# EAGLE design KeyboardSidepanel_stack2 (EAGLE 7.7.0)
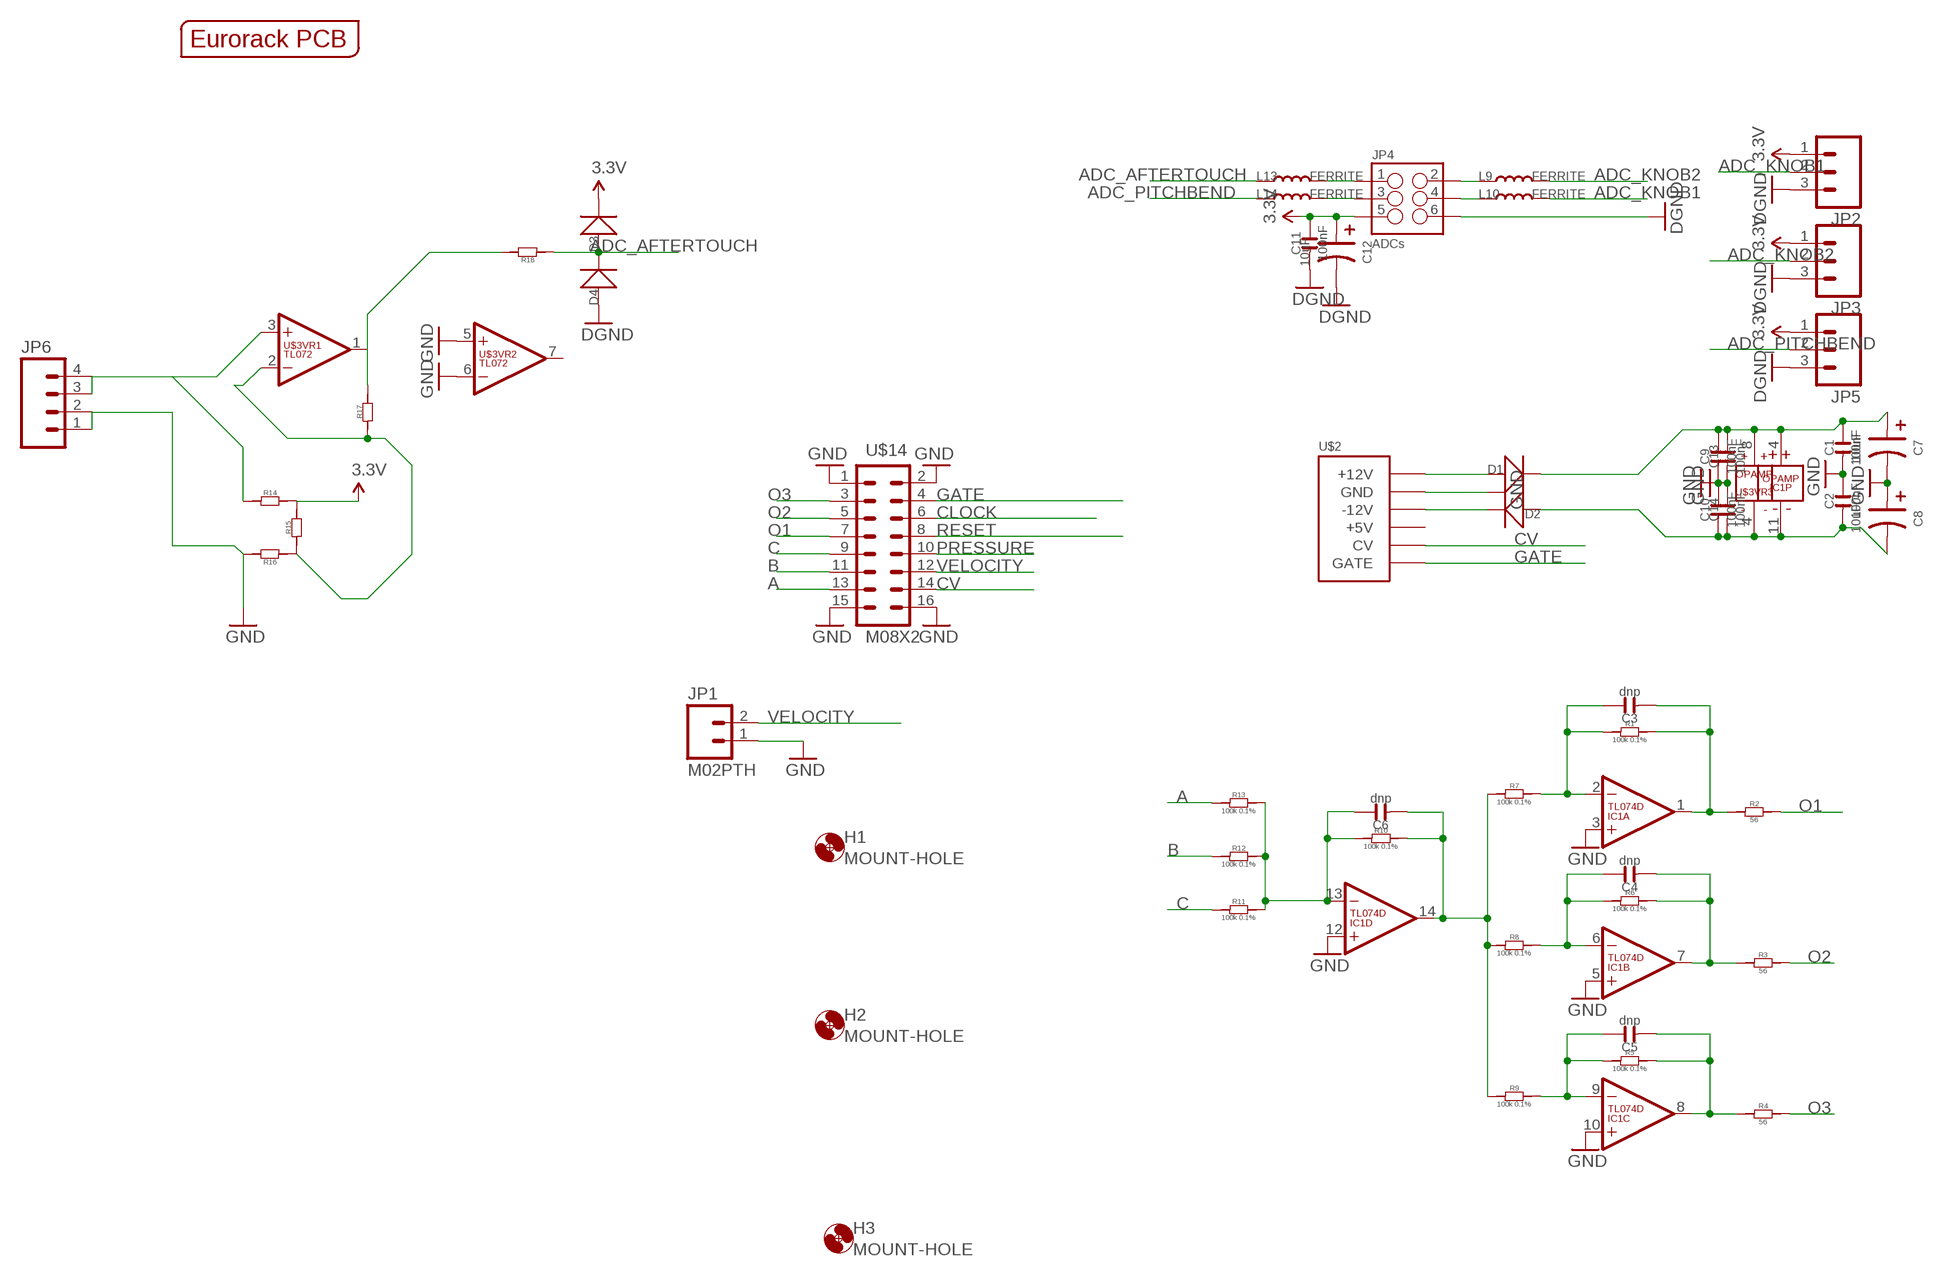
[diagram p0: schematic, sheet 1]

## Parts
C1  100nF  C-0603  [C0603]
C2  100nF  C-0603  [C0603]
C3  dnp  C-0603  [C0603]
C4  dnp  C-0603  [C0603]
C5  dnp  C-0603  [C0603]
C6  dnp  C-0603  [C0603]
C7  10uF  C-POLAR-A  [CASE-A_3216]
C8  10uF  C-POLAR-A  [CASE-A_3216]
C9  100nF  C-0603  [C0603]
C10  100nF  C-0603  [C0603]
C11  100nF  C-0603  [C0603]
C12  10uF  C-POLAR-A  [CASE-A_3216]
C13  100nF  C-0603  [C0603]
C14  100nF  C-0603  [C0603]
D1  D-SOD-123  [SOD123]
D2  D-SOD-123  [SOD123]
D3  D-SOD-123  [SOD123]
D4  D-SOD-123  [SOD123]
H1  MOUNT-HOLE  [3.2-NOMARKINGS-SMALLSAFEZONE]
H2  MOUNT-HOLE  [3.2-NOMARKINGS-SMALLSAFEZONE]
H3  MOUNT-HOLE  [3.2-NOMARKINGS-SMALLSAFEZONE]
IC1  TL074D  [SO14]
JP1  M02PTH  [1X02]
JP2  M03PTH  [1X03]
JP3  M03PTH  [1X03]
JP4  ADCs  M03X2  [2X3-SHROUDED]
JP5  M03PTH  [1X03]
JP6  M04PTH  [1X04]
L9  FERRITE  L-0603  [L0603]
L10  FERRITE  L-0603  [L0603]
L13  FERRITE  L-0603  [L0603]
L14  FERRITE  L-0603  [L0603]
R1  100k 0.1%  R-0603  [R0603]
R2  56  R-0603  [R0603]
R3  56  R-0603  [R0603]
R4  56  R-0603  [R0603]
R5  100k 0.1%  R-0603  [R0603]
R6  100k 0.1%  R-0603  [R0603]
R7  100k 0.1%  R-0603  [R0603]
R8  100k 0.1%  R-0603  [R0603]
R9  100k 0.1%  R-0603  [R0603]
R10  100k 0.1%  R-0603  [R0603]
R11  100k 0.1%  R-0603  [R0603]
R12  100k 0.1%  R-0603  [R0603]
R13  100k 0.1%  R-0603  [R0603]
R14  R-0603  [R0603]
R15  R-0603  [R0603]
R16  R-0603  [R0603]
R17  R-0603  [R0603]
R18  R-0603  [R0603]
U$1  EURORACK_PCB6HP_10CM  [EURORACK6HPPCB_10CMTALL]
U$2  POWERSHROUDED  [POWER_16_SHROUDED]
U$3  TL072  [SO08]
U$14  M08X2  [2X8]

## Nets
3.3V [heavypower]: C11.2 C12.+ D3.- JP2.1 JP3.1 JP4.5 JP5.1 R14.2 R15.2
12V: C1.2 C7.+ C9.2 C13.2 D1.- IC1.4(P:V+) U$3.8(VR3:V+)
-12V: C2.1 C8.- C10.1 C14.1 D2.+ IC1.11(P:V-) U$3.4(VR3:V-)
A: R13.1 U$14.13
ADC_AFTERTOUCH: D3.+ D4.- L13.1 R18.1
ADC_KNOB1: JP2.2 L10.2
ADC_KNOB2: JP3.2 L9.2
ADC_PITCHBEND: JP5.2 L14.1
B: R12.1 U$14.11
C: R11.1 U$14.9
CLOCK: U$14.6
CV: U$2.13(CV) U$2.14(CV) U$14.14
GATE: U$2.15(GATE) U$2.16(GATE) U$14.4
GND: C1.1 C2.2 C7.- C8.+ C9.1 C10.2 C11.1 C12.- C13.1 C14.2 D4.+ IC1.3(A:+IN) IC1.5(B:+IN) IC1.10(C:+IN) IC1.12(D:+IN) JP1.1 JP2.3 JP3.3 JP4.6 JP5.3 JP6.1 JP6.2 R16.2 U$2.3(GND) U$2.4(GND) U$2.5(GND) U$2.6(GND) U$2.7(GND) U$2.8(GND) U$3.5(VR2:+IN) U$3.6(VR2:-IN) U$14.1 U$14.2 U$14.15 U$14.16 ; supply symbol labelled DGND
N$1: C6.1 IC1.14(D:OUT) R7.1 R8.1 R9.1 R10.2
N$2: R17.2 R18.2 U$3.1(VR1:OUT)
N$3: R15.1 R16.1 R17.1 U$3.2(VR1:-IN)
N$4: C6.2 IC1.13(D:-IN) R10.1 R11.2 R12.2 R13.2
N$7: C3.2 IC1.2(A:-IN) R1.1 R7.2
N$8: C4.2 IC1.6(B:-IN) R6.1 R8.2
N$9: C5.2 IC1.9(C:-IN) R5.1 R9.2
N$10: C5.1 IC1.8(C:OUT) R4.1 R5.2
N$11: C4.1 IC1.7(B:OUT) R3.1 R6.2
N$14: C3.1 IC1.1(A:OUT) R1.2 R2.1
N$22: D1.+ U$2.9(+12V) U$2.10(+12V)
N$23: D2.- U$2.1(-12V) U$2.2(-12V)
N$27: JP4.2 L9.1
N$49: JP4.4 L10.1
N$50: JP4.1 L13.2
N$51: JP4.3 L14.2
O1: R2.2 U$14.7
O2: R3.2 U$14.5
O3: R4.2 U$14.3
PRESSURE: U$14.10
RESET: U$14.8
VELOCITY: JP1.2 U$14.12
WHEATR1: JP6.3 JP6.4 R14.1 U$3.3(VR1:+IN)
Unconnected: U$2.11(+5V) U$2.12(+5V) U$3.7(VR2:OUT)

## Library data of the parts
C1-C6 C9-C11 C13 C14 = OPL:C*
C7 C8 C12 = EurorackModularParts:C-POLAR*
D1-D4 = OPL:D*: DIODE
H1-H3 = zephod-components:MOUNT-HOLE: MOUNTING HOLE with drill center marker
IC1 = EurorackModularParts:TL074: OP AMP
JP1 = SparkFun-Connectors:M02: Standard 2-pin 0.1" header. Use with - straight break away headers ( PRT-00116) - right angle break away headers (PRT-00553) - swiss pins (PRT-00743) - machine pins (PRT-00117) - female headers (PRT-00115) Molex polarized connector foot print use with: PRT-08233 with associated crimp pins and housings. 2.54_SCREWTERM for use with PRT-10571. 3.5mm Screw Terminal footprints for PRT-08084 5mm Screw Terminal footprints for use with PRT-08433
JP2 JP3 JP5 = SparkFun-Connectors:M03: Header 3 Standard 3-pin 0.1" header. Use with straight break away headers (SKU : PRT-00116), right angle break away headers (PRT-00553), swiss pins (PRT-00743), machine pins (PRT-00117), and female headers (PRT-00115). Molex polarized connector foot print use with SKU : PRT-08232 with associated crimp pins and housings.
JP4 = SparkFun-Connectors:M03X2: 2x3 .1" header. Shrouded, with keying- CONN-10681 SMT- CONN-11415 Pogo pins- HW-11044; PROD_ID: CONN-10681
JP6 = SparkFun-Connectors:M04: Header 4 Standard 4-pin 0.1" header. Use with straight break away headers (SKU : PRT-00116), right angle break away headers (PRT-00553), swiss pins (PRT-00743), machine pins (PRT-00117), and female headers (PRT-00115). Molex polarized connector foot print use with SKU : PRT-08231 with associated crimp pins and housings. 1MM SMD Version SKU: PRT-10208
L9 L10 L13 L14 = OPL Eagle Library:L*
R1-R18 = OPL:R*
U$1 = EurorackModularParts:EURORACK_PCB
U$2 = EurorackModularParts:POWER
U$3 = EurorackModularParts:TL072
U$14 = SparkFun-Connectors:M08X2: .1" headers, two rows of 8 each

## Net classes
0 default: width 0.305 mm
1 heavypower: width 0.305 mm
3 groundplane: width 0.305 mm

## Board
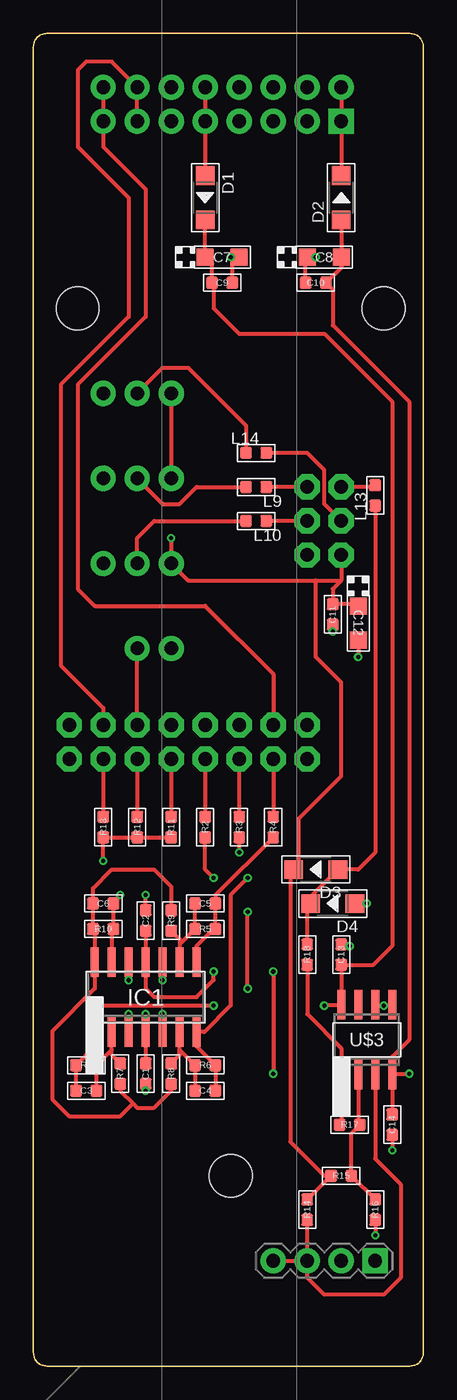
[diagram p1: board, top side]
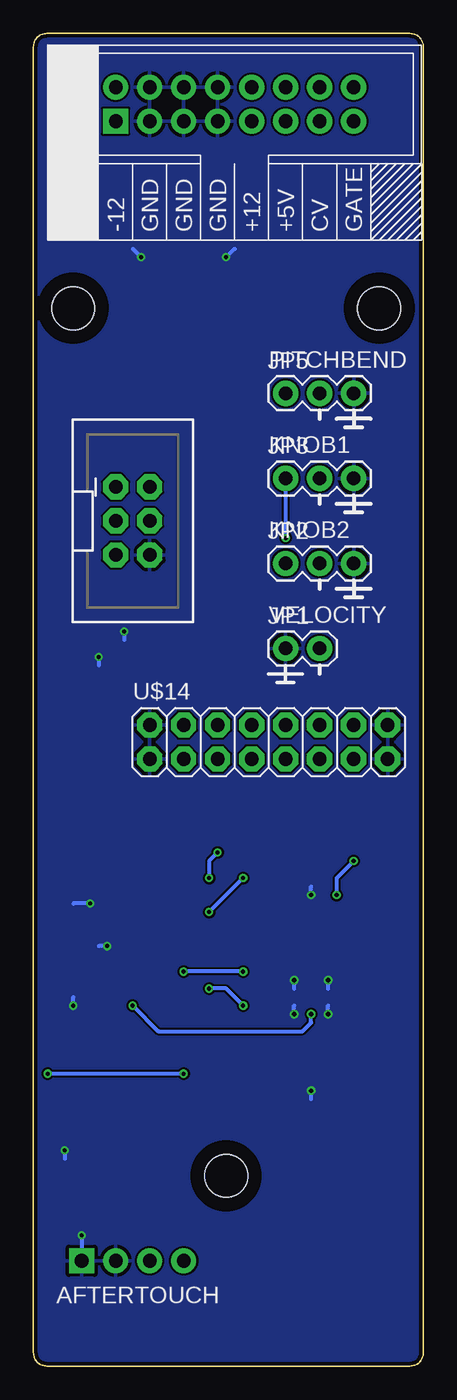
[diagram p2: board, bottom side, seen from below]

Size 29.14 x 99.5 mm. Coordinates in mm from the lower left corner, seen from the top.
Copper layers (1*16): Top 0.035mm / dielectric 1.5mm / Bottom 0.035mm
Design rules "ITEADstudio_DRC": minimum track width 6mil, minimum drill 12mil, track to track 6mil, track to pad 6mil, pad to pad 6mil, via to via 6mil, smd to smd 0mil, copper to edge 10mil, drill to drill 10mil, minimum pad ring 10mil, minimum via ring 6mil, stop-mask expansion 2mil, vias tented up to drill 100mil, thermal gap 10mil

### Footprints (pad centres in the part's own frame; a part is rotated, then mirrored left to right if it is on the bottom)
C0603 = smd 0.889 x 0.889: 1 -0.762,0; 2 0.762,0
CASE-A_3216 = smd 1.27 x 1.27: + -1.27,0; - 1.27,0
SOD123 = smd 1.397 x 1.397: + -1.651,0; - 1.651,0
3.2-NOMARKINGS-SMALLSAFEZONE = hole 3.2: 0,0
SO14 = smd 0.6 x 2.2: 1 -3.81,-2.6; 2 -2.54,-2.6; 3 -1.27,-2.6; 4 0,-2.6; 5 1.27,-2.6; 6 2.54,-2.6; 7 3.81,-2.6; 8 3.81,2.6; 9 2.54,2.6; 10 1.27,2.6; 11 0,2.6; 12 -1.27,2.6; 13 -2.54,2.6; 14 -3.81,2.6
1X02 = drill 1.016 pad 1.88: 1 0,0; 2 2.54,0
1X03 = drill 1.016 pad 1.88: 1 0,0; 2 2.54,0; 3 5.08,0
2X3-SHROUDED = drill 1.016 pad 1.88 octagon: 1 -1.27,2.54; 2 1.27,2.54; 3 -1.27,0; 4 1.27,0; 5 -1.27,-2.54; 6 1.27,-2.54
1X04 = drill 1.016 pad 1.88 square: 1 0,0 | drill 1.016 pad 1.88: 2 2.54,0; 3 5.08,0; 4 7.62,0
L0603 = smd 0.889 x 0.889: 1 -0.762,0; 2 0.762,0
R0603 = smd 0.889 x 0.889: 1 -0.762,0; 2 0.762,0
POWER_16_SHROUDED = drill 1.016 pad 1.88 square: 1 -8.89,-1.27 | drill 1.016 pad 1.88: 2 -8.89,1.27; 3 -6.35,-1.27; 4 -6.35,1.27; 5 -3.81,-1.27; 6 -3.81,1.27; 7 -1.27,-1.27; 8 -1.27,1.27; 9 1.27,-1.27; 10 1.27,1.27; 11 3.81,-1.27; 12 3.81,1.27; 13 6.35,-1.27; 14 6.35,1.27; 15 8.89,-1.27; 16 8.89,1.27
SO08 = smd 0.6 x 2.2: 1 -1.905,-2.6; 2 -0.635,-2.6; 3 0.635,-2.6; 4 1.905,-2.6; 5 1.905,2.6; 6 0.635,2.6; 7 -0.635,2.6; 8 -1.905,2.6
2X8 = drill 1.016 pad 1.88 octagon: 1 0,0; 2 0,2.54; 3 2.54,0; 4 2.54,2.54; 5 5.08,0; 6 5.08,2.54; 7 7.62,0; 8 7.62,2.54; 9 10.16,0; 10 10.16,2.54; 11 12.7,0; 12 12.7,2.54; 13 15.24,0; 14 15.24,2.54; 15 17.78,0; 16 17.78,2.54

### Placement (x,y rotation side)
C1  8.39,21.83 90 top
C2  8.39,33.26 90 top
C3  3.95,20.56 0 top
C4  12.84,20.56 180 top
C5  12.84,34.53 180 top
C6  5.21,34.53 0 top
C7  14.11,82.79 0 top
C8  21.73,82.79 0 top
C9  14.11,80.89 180 top
C10  21.09,80.89 180 top
C11  22.36,56.12 90 top
C12  24.27,55.48 270 top
C13  23,30.72 270 top
C14  26.8,18.02 270 top
D1  12.84,87.23 270 top
D2  23,87.23 90 top
D3  21.09,37.07 180 top
D4  22.36,34.53 180 top
H1  14.74,14.21 0 top
H2  3.31,78.98 0 top
H3  26.17,78.98 0 top
IC1  8.39,27.55 0 top
JP1  10.29,53.58 0 bottom
JP2  10.29,59.93 0 bottom
JP3  10.29,66.28 0 bottom
JP4  21.73,63.11 0 bottom
JP5  10.29,72.63 0 bottom
JP6  25.54,7.86 180 top
L9  16.64,65.64 180 top
L10  16.64,63.11 180 top
L13  25.54,65.01 90 top
L14  16.64,68.19 0 top
R1  3.95,22.47 180 top
R2  12.84,40.24 90 top
R3  15.38,40.24 90 top
R4  17.91,40.24 90 top
R5  12.84,32.62 0 top
R6  12.84,22.47 0 top
R7  6.49,21.83 90 top
R8  10.29,21.83 90 top
R9  10.29,33.26 270 top
R10  5.21,32.62 180 top
R11  10.29,40.24 270 top
R12  7.76,40.24 270 top
R13  5.21,40.24 270 top
R14  20.45,11.67 90 top
R15  23,14.21 180 top
R16  25.54,11.67 270 top
R17  23.63,18.02 180 top
R18  20.45,30.72 270 top
U$1  -0.5,-15 0 top  (outside the outline)
U$2  14.11,94.22 0 bottom
U$3  24.9,24.37 0 top
U$14  20.45,45.33 0 bottom

### Tracks (layer width: path | path; a pad name or v marks a point on that pad's centre or on a via)
3.3V  (via drill 0.3)
  Top 0.305: JP4.5 23,58.66 | JP5.1 JP3.1 | v10.29,61.83 JP2.1 11.56,58.66 21.09,58.66 | R14.2 R15.2 21.73,14.21 19.18,16.75 19.18,36.82 D3.- 19.82,37.45 19.82,40.88 23,44.05 23,51.04 21.09,52.94 21.09,58.66 | 21.09,58.66 23,58.66 | 23,58.66 22.36,58.03 C11.2 24.14,56.88 C12.+
  Bottom 0.305: JP3.1 v10.29,61.83
12V  (via drill 0.3)
  Top 0.305: D1.- C7.+ 13.34,82.28 C9.2 13.47,80.76 13.47,78.98 15.38,77.08 21.73,77.08 26.8,72 26.8,31.35 25.41,29.96 C13.2 U$3.8 22.93,26.91 v21.73,26.91 | C1.2 IC1.4 v8.39,26.27
  Bottom 0.305: v21.73,26.91 19.82,25.01 9.03,25.01 8.39,25.64 v8.39,26.27
-12V  (via drill 0.3)
  Top 0.305: D2.+ C8.- 23,82.03 C10.1 22.36,80.38 22.36,77.71 28.07,72 28.07,24.37 26.8,23.1 U$3.4 | U$3.4 C14.1 | C2.1 IC1.11 8.39,28.18 9.03,27.55 12.2,27.55 13.47,28.81 v13.47,29.45 | v17.91,29.45 v17.91,21.83 | v28.07,21.83 28.02,21.77 U$3.4
  Bottom 0.305: v13.47,29.45 v17.91,29.45 | v17.91,21.83 v28.07,21.83
A
  Top 0.305: U$14.13 R13.1
ADC_AFTERTOUCH
  Top 0.305: L13.1 25.54,38.34 24.27,37.07 D3.+ | D3.+ 22.61,36.94 | R18.1 20.45,34.28 D4.- 20.71,35.04 D3.+
ADC_KNOB1
  Top 0.305: JP2.2 7.76,61.83 9.03,63.11 L10.2
ADC_KNOB2
  Top 0.305: JP3.2 9.66,64.38 10.93,64.38 12.2,65.64 L9.2
ADC_PITCHBEND
  Top 0.305: JP5.2 9.66,74.53 11.56,74.53 15.88,70.22 L14.1
B
  Top 0.305: U$14.11 R12.1
C
  Top 0.305: U$14.9 R11.1
CV
  Top 0.305: U$2.13 U$2.14 5.85,97.39 3.95,97.39 3.31,96.76 3.31,91.05 7.12,87.23 7.12,78.34 2.04,73.27 2.04,52.31 5.21,49.14 U$14.14
GATE
  Top 0.305: U$2.16 U$2.15 5.21,91.05 8.39,87.87 8.39,78.34 3.31,73.27 3.31,58.03 4.58,56.75 12.84,56.75 17.91,51.67 U$14.4
GND  (via drill 0.3)
  Top 0.305: C10.2 20.33,82.66 C8.+ v21.09,82.79 | C9.1 14.87,82.28 C7.- v14.74,82.79 | U$3.6 25.59,26.91 v26.17,26.91 26.75,26.91 U$3.5 | C13.1 23.12,31.35 v23.63,31.35 | D4.+ v24.9,34.53 | R16.2 v25.54,9.77 | C14.2 v26.8,16.11 | C2.2 v8.39,35.16 | IC1.10 v9.66,28.81 | IC1.12 v7.12,28.81 | IC1.3 v7.12,26.27 | IC1.5 v9.66,26.27 | C1.1 v8.39,20.56 | C12.- v24.27,52.94 | C11.1 v22.36,54.85
  Bottom 0.305: v14.74,82.79 14.11,83.42 | v21.09,82.79 21.73,83.42 | v26.17,26.91 26.17,27.55 | v23.63,31.35 24.27,31.35 | v24.9,34.53 26.17,34.53 | v25.54,9.77 JP6.1 | v26.8,16.11 26.8,15.48 | v8.39,35.16 8.39,35.8 | v9.66,28.81 9.66,28.18 | v7.12,28.81 7.12,28.18 | v7.12,26.27 7.12,26.91 | v9.66,26.27 9.66,26.91 | v8.39,20.56 8.39,19.92 | v24.27,52.94 24.27,52.31 | v22.36,54.85 22.36,54.22
  pour Bottom: -1.14,101.2 30.52,101.2 arc-90 32.52,99.2 32.52,-4.21 0.86,-4.21 arc-90 -1.14,-2.21
N$1
  Top 0.305: R8.1 10.29,20.56 9.03,19.29 7.76,19.29 7.44,19.61 | R7.1 6.49,20.56 7.44,19.61 | 7.44,19.61 6.49,18.66 2.67,18.66 1.41,19.92 1.41,25.01 4.58,28.18 IC1.14 4.58,32.5 R10.2 C6.1 4.45,35.67 5.85,37.07 9.03,37.07 10.29,35.8 R9.1
N$2
  Top 0.305: R18.2 20.45,26.27 23,23.73 U$3.1 | 23,21.2 U$3.1 | U$3.1 23,18.15 R17.2
N$3
  Top 0.305: U$3.2 24.27,18.15 R17.1 23.76,17.38 R15.1 R16.1
N$4  (via drill 0.3)
  Top 0.305: IC1.13 5.85,32.5 R10.1 C6.2 5.98,34.66 v6.49,35.16 | R11.2 R12.2 R13.2 v5.21,37.7
  Bottom 0.305: v6.49,35.16 6.49,36.44 v5.21,37.7
N$7
  Top 0.305: R7.2 5.85,23.23 IC1.2 5.85,23.61 R1.1 C3.2
N$8
  Top 0.305: C4.2 R6.1 10.93,23.61 IC1.6 10.93,23.23 R8.2
N$9
  Top 0.305: R9.2 10.93,31.86 IC1.9 | 10.93,29.45 IC1.9 | IC1.9 10.93,31.48 R5.1 C5.2
N$10
  Top 0.305: IC1.8 12.2,31.35 13.47,32.62 R5.2 C5.1 13.6,35.16 R4.1
N$11  (via drill 0.3)
  Top 0.305: R3.1 v15.38,38.34 | v16.01,36.44 14.74,35.16 14.74,26.91 12.78,24.95 IC1.7 12.2,23.86 R6.2 C4.1
  Bottom 0.305: v15.38,38.34 16.01,37.7 v16.01,36.44
N$14  (via drill 0.3)
  Top 0.305: C3.1 R1.2 4.58,23.86 IC1.1 4.58,26.27 5.21,26.91 v13.47,26.91 | v16.01,28.18 v16.01,33.9 | v13.47,36.44 12.84,37.07 R2.1
  Bottom 0.305: v13.47,26.91 14.74,28.18 v16.01,28.18 | v16.01,33.9 v13.47,36.44
N$22
  Top 0.305: U$2.10 U$2.9 D1.+
N$23
  Top 0.305: U$2.2 U$2.1 D2.-
N$27
  Top 0.305: JP4.2 L9.1
N$49
  Top 0.305: JP4.4 L10.1
N$50
  Top 0.305: L13.2 25.41,65.64 JP4.1
N$51
  Top 0.305: JP4.3 21.73,64.38 21.73,66.92 20.45,68.19 L14.2
O1
  Top 0.305: U$14.7 R2.2
O2
  Top 0.305: U$14.5 R3.2
O3
  Top 0.305: U$14.3 R4.2
VELOCITY
  Top 0.305: U$14.12 JP1.2
WHEATR1
  Top 0.305: JP6.4 JP6.3 | JP6.3 R14.1 | U$3.3 25.54,15.48 27.44,13.57 27.44,6.59 26.17,5.32 21.73,5.32 20.45,6.59 JP6.3

### Text on the board
bPlace: PITCHBEND | KNOB1 | KNOB2 | VELOCITY | AFTERTOUCH